# EAGLE design untitled (EAGLE 7.7.0)
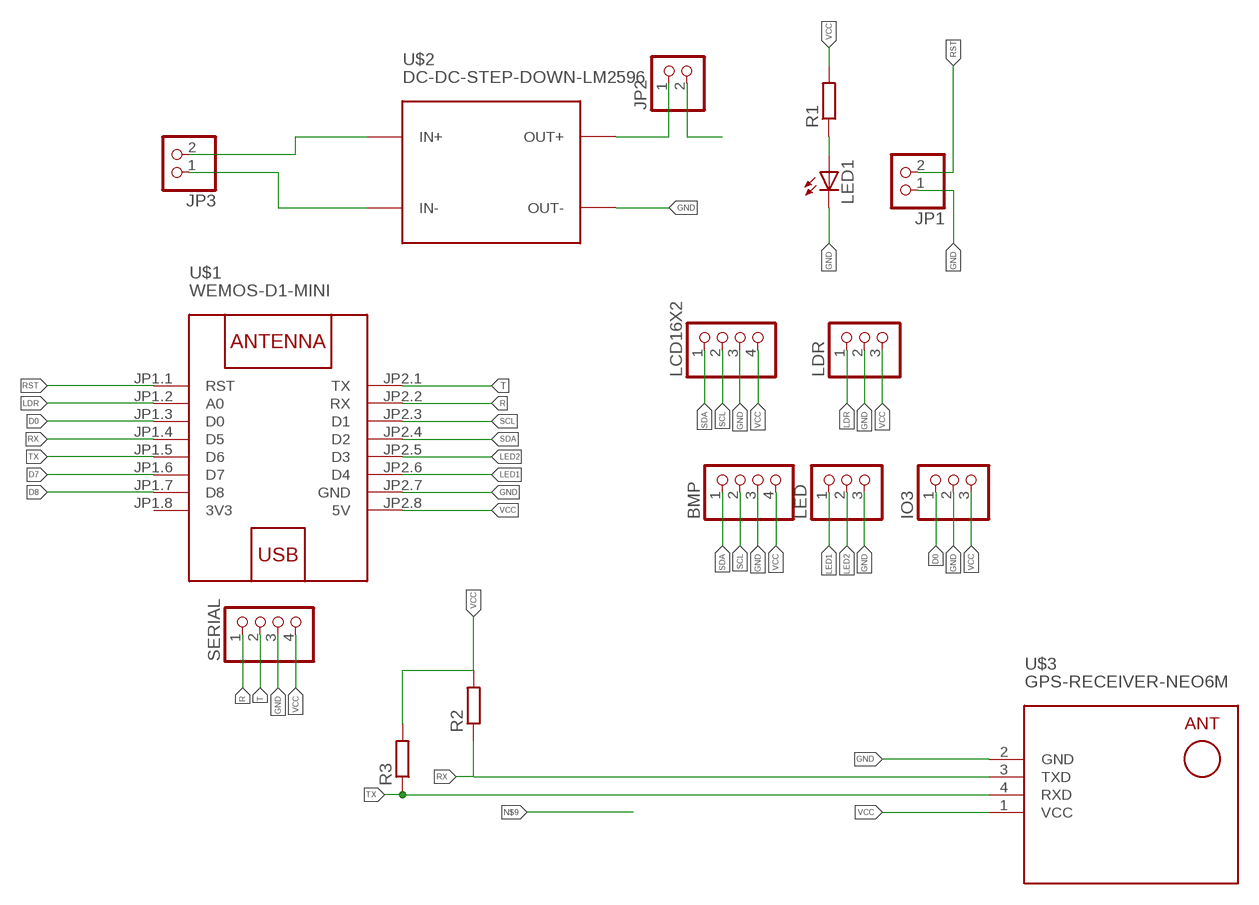
[diagram p0: schematic, sheet 1]

## Parts
BMP  PINHD-1X4  [1X04]
IO3  PINHD-1X3  [1X03]
JP1  PINHD-1X2  [1X02]
JP2  PINHD-1X2  [1X02]
JP3  PINHD-1X2  [1X02]
LCD16X2  PINHD-1X4  [1X04]
LDR  PINHD-1X3  [1X03]
LED  PINHD-1X3  [1X03]
LED1  LED5MM  [LED5MM]
R1  R-EU_0204/7  [0204/7]
R2  R-EU_0204/7  [0204/7]
R3  R-EU_0204/7  [0204/7]
SERIAL  PINHD-1X4  [1X04]
U$1  WEMOS-D1-MINI  [WEMOS-D1-MINI]
U$2  DC-DC-STEP-DOWN-LM2596  [DC-DC-STEP-DOWN-LM2596]
U$3  GPS-RECEIVER-NEO6M  [GPS-RECEIVER-NEO6M]

## Nets
D0: IO3.1 U$1.JP1.3(D0)
D7: U$1.JP1.6(D7)
D8: U$1.JP1.7(D8)
GND: BMP.3 IO3.2 JP1.1 LCD16X2.3 LDR.2 LED1.K(C) LED.3 SERIAL.3 U$1.JP2.7(GND) U$2.OUT- U$3.2(GND)
LDR: LDR.1 U$1.JP1.2(A0)
LED1: LED.1 U$1.JP2.6(D4)
LED2: LED.2 U$1.JP2.5(D3)
N$1: JP3.1 U$2.IN-
N$2: JP3.2 U$2.IN+
N$3: JP2.1 U$2.OUT+
N$4: LED1.A R1.1
R: SERIAL.1 U$1.JP2.2(RX)
RST: JP1.2 U$1.JP1.1(RST)
RX: R2.1 U$1.JP1.4(D5) U$3.3(TXD)
SCL: BMP.2 LCD16X2.2 U$1.JP2.3(D1)
SDA: BMP.1 LCD16X2.1 U$1.JP2.4(D2)
T: SERIAL.2 U$1.JP2.1(TX)
TX: R3.1 U$1.JP1.5(D6) U$3.4(RXD)
VCC: BMP.4 IO3.3 JP2.2 LCD16X2.4 LDR.3 R1.2 R2.2 R3.2 SERIAL.4 U$1.JP2.8(5V) U$3.1(VCC)

## Power pins joined to a net without a drawn wire
3V3: U$1.JP1.8(3V3)

## Library data of the parts
BMP LCD16X2 SERIAL = pinhead:PINHD-1X4: PIN HEADER
IO3 LDR LED = pinhead:PINHD-1X3: PIN HEADER
JP1-JP3 = pinhead:PINHD-1X2: PIN HEADER
LED1 = led:LED: LED OSRAM: - CHIPLED LG R971, LG N971, LY N971, LG Q971, LY Q971, LO R971, LY R971 LH N974, LH R974 LS Q976, LO Q976, LY Q976 LO Q996 - Hyper CHIPLED LW Q18S LB Q993, LB Q99A, LB R99A - SideLED LS A670, LO A670, LY A670, LG A670, LP A670 LB A673, LV A673, LT A673, LW A673 LH A674 LY A675 LS A676, LA A676, LO A676, LY A676, LW A676 LS A679, LY A679, LG A679 - Hyper Micro SIDELED® LS Y876, LA Y876, LO Y876, LY Y876 LT Y87S - SmartLED LW L88C, LW L88S LB L89C, LB L89S, LG L890 LS L89K, LO L89K, LY L89K LS L896, LA L896, LO L896, LY L896 - TOPLED LS T670, LO T670, LY T670, LG T670, LP T670 LSG T670, LSP T670, LSY T670, LOP T670, LYG T670 LG T671, LOG T671, LSG T671 LB T673, LV T673, LT T673, LW T673 LH T674 LS T676, LA T676, LO T676, LY T676, LB T676, LH T676, LSB T676, LW T676 LB T67C, LV T67C, LT T67C, LS T67K, LO T67K, LY T67K, LW E67C LS E67B, LA E67B, LO E67B, LY E67B, LB E67C, LV E67C, LT E67C LW T67C LS T679, LY T679, LG T679 LS T770, LO T770, LY T770, LG T770, LP T770 LB T773, LV T773, LT T773, LW T773 LH T774 LS E675, LA E675, LY E675, LS T675 LS T776, LA T776, LO T776, LY T776, LB T776 LHGB T686 LT T68C, LB T68C - Hyper Mini TOPLED® LB M676 - Mini TOPLED Santana® LG M470 LS M47K, LO M47K, LY M47K Source: http://www.osram.convergy.de/
R1-R3 = resistor:R-EU_: RESISTOR, European symbol
U$1 = diy-modules:WEMOS-D1-MINI: WEMOS D1 mini: Mini Wi-Fi Board based on ESP-8266 device More details can be found here: https://www.wemos.cc/product/d1-mini.html Click here to find device on ebay.com <http://www.ebay.com/sch/wemos+d1+mini+nodemcu>
U$2 = diy-modules:DC-DC-STEP-DOWN-LM2596: DC/DC Step-Down Regulator based on LM2596-ADJ chip LM2596 datasheet available here: http://www.ti.com/lit/ds/symlink/lm2596.pdf Click here to find device on ebay.com <http://www.ebay.com/sch/lm2596+power+regulator>
U$3 = diy-modules:GPS-RECEIVER-NEO6M: GPS Receiver Module based on NEO-6 device Short tutorial how to use NEO-6 module with Arduino: http://www.xarg.org/2016/06/neo6mv2-gps-module-with-arduino/ NEO-6 datasheet is available here: https://www.u-blox.com/sites/default/files/products/documents/NEO-6_DataSheet_%28GPS.G6-HW-09005%29.pdf Click here to find device on ebay.com <http://www.ebay.com/sch/gyneo6mv2>

## Board
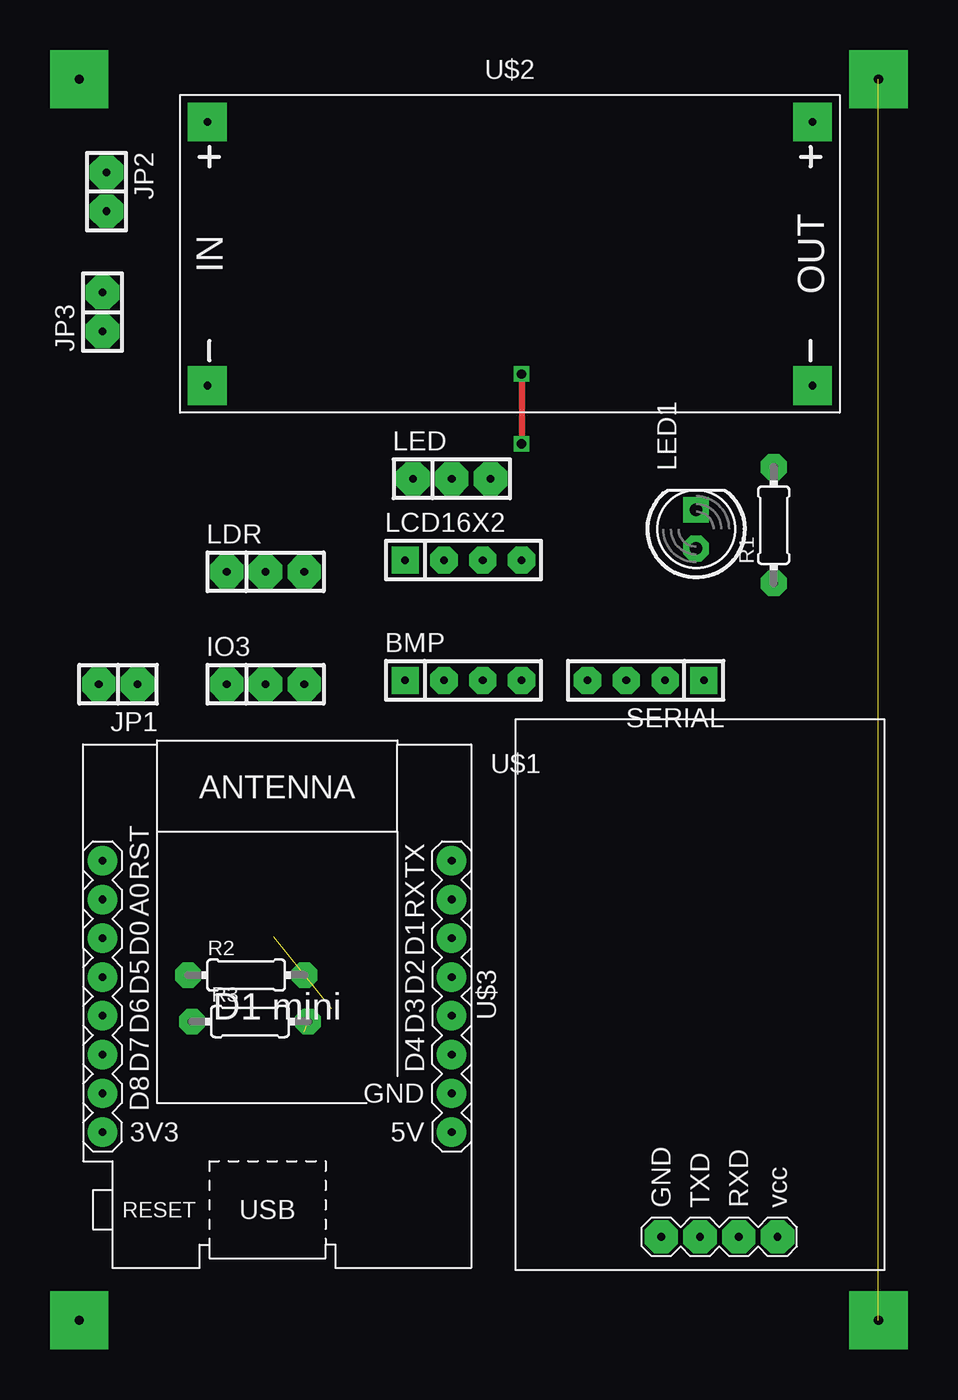
[diagram p1: board, top side]
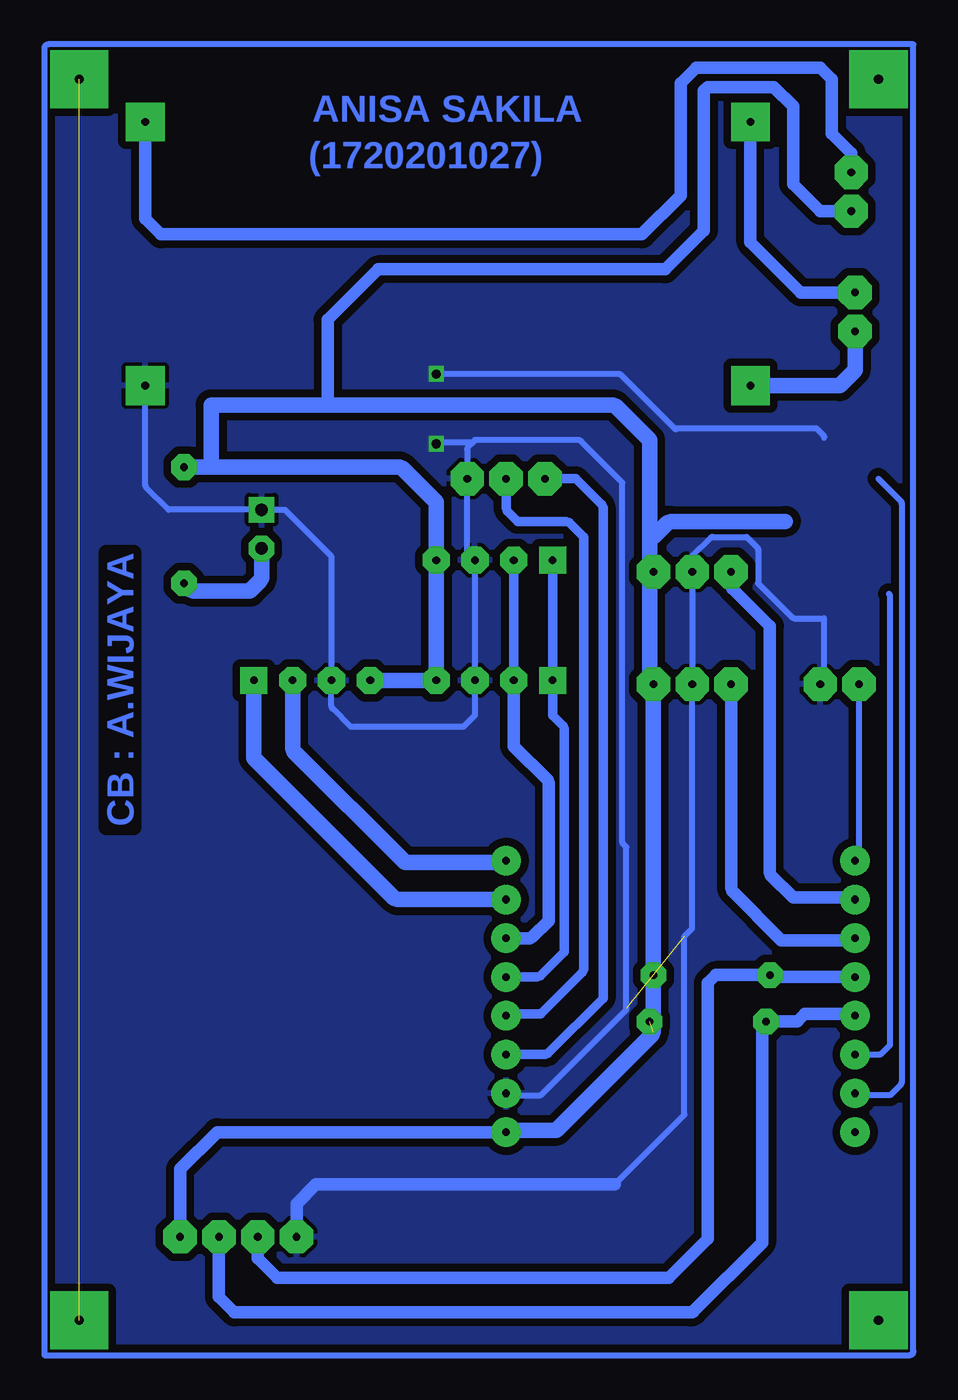
[diagram p2: board, bottom side, seen from below]

No outline drawn. Coordinates in mm, seen from the top.
Copper layers (1*16): Top 0.035mm / dielectric 1.5mm / Bottom 0.035mm
Design rules "default *": minimum track width 10mil, minimum drill 24mil, track to track 20mil, track to pad 20mil, pad to pad 20mil, via to via 20mil, smd to smd 8mil, copper to edge 20mil, drill to drill 8mil, minimum pad ring 10mil, minimum via ring 8mil, stop-mask expansion 4mil, vias tented up to drill 0mil, thermal gap 10mil

### Footprints (pad centres in the part's own frame; a part is rotated, then mirrored left to right if it is on the bottom)
1X04 = drill 0.5 pad 1.778 square: 1 -3.81,0 | drill 0.5 pad 1.778 octagon: 2 -1.27,0; 3 1.27,0; 4 3.81,0
1X03 = drill 0.5 pad 2.184 octagon: 1 -2.54,0; 2 0,0; 3 2.54,0
1X02 = drill 0.5 pad 2.184 octagon: 1 -1.27,0; 2 1.27,0
LED5MM = drill 0.813 pad 1.676 octagon: A -1.27,0 | drill 0.813 pad 1.676 square: K 1.27,0
0204/7 = drill 0.5 pad 1.676 octagon: 1 -3.81,0; 2 3.81,0
WEMOS-D1-MINI = drill 0.5 pad 1.93: JP1.1 -11.43,9.525; JP1.2 -11.43,6.985; JP1.3 -11.43,4.445; JP1.4 -11.43,1.905; JP1.5 -11.43,-0.635; JP1.6 -11.43,-3.175; JP1.7 -11.43,-5.715; JP1.8 -11.43,-8.255; JP2.1 11.43,9.525; JP2.2 11.43,6.985; JP2.3 11.43,4.445; JP2.4 11.43,1.905; JP2.5 11.43,-0.635; JP2.6 11.43,-3.175; JP2.7 11.43,-5.715; JP2.8 11.43,-8.255
DC-DC-STEP-DOWN-LM2596 = drill 0.5 pad 2.54 square: IN+ -19.812,8.636; IN- -19.812,-8.636; OUT+ 19.812,8.636; OUT- 19.812,-8.636
GPS-RECEIVER-NEO6M = drill 0.5 pad 2.184 octagon: 1 -15.875,-5.08; 2 -15.875,2.54; 3 -15.875,0; 4 -15.875,-2.54

### Placement (x,y rotation side)
BMP  27.43,58.42 0 top
IO3  14.48,58.17 0 top
JP1  4.83,58.17 180 top
JP2  4.06,90.42 270 top
JP3  3.81,82.55 90 top
LCD16X2  27.43,66.29 0 top
LDR  14.48,65.53 0 top
LED  26.67,71.63 0 top
LED1  42.67,68.33 90 top
R1  47.75,68.58 90 top
R2  13.21,39.12 0 top
R3  13.46,36.07 0 top
SERIAL  39.37,58.42 180 top
U$1  15.24,37.08 0 top
U$2  30.48,86.36 0 top
U$3  42.93,37.85 90 top

### Tracks (layer width: path | path; a pad name or v marks a point on that pad's centre or on a via)
D0
  Bottom 0.406: U$1.JP1.3 3.86,41.48 arc45 4.04,41.4 | 11.86,44.63 arc45 11.94,44.81
  Bottom 0.813: 4.04,41.4 8.64,41.4 11.86,44.63 | 11.94,44.81 IO3.1
D7
  Bottom 0.406: U$1.JP1.6 2.26,33.91 arc-45 2.08,33.98 1.52,34.54 1.52,63.9 arc-45 1.6,64.08
D8
  Bottom 0.406: U$1.JP1.7 3.76,31.32 arc-45 3.58,31.24 1.52,31.24 0.84,31.93 arc-45 0.76,32.11 0.76,70 arc-45 0.84,70.18 2.29,71.63
GND  (via drill 0.6)  (1 unrouted)
  Top 0.406: v31.24,78.49 v31.24,73.91
  Bottom 0.406: JP1.1 5.92,58.35 arc-45 5.84,58.52 5.84,62.48 7.77,62.48 arc45 7.95,62.56 10.16,64.77 10.16,66.95 arc-45 10.23,67.13 10.92,67.82 13.1,67.82 arc-45 13.28,67.74 14.48,66.55 LDR.2 IO3.2 14.48,42.16 14.99,41.66 14.99,29.97 19.56,25.4 | U$1.JP2.7 26.62,31.32 arc-45 26.44,31.24 24.38,31.24 18.87,36.76 arc-45 18.8,36.94 18.8,47.5 18.98,47.68 arc45 19.05,47.86 19.05,71.37 21.77,74.09 | 21.77,74.09 arc-45 21.95,74.17 | 21.95,74.17 28.7,74.17 28.83,74.04 | 28.83,74.04 29.14,73.73 arc-45 29.21,73.56 LED.3 29.21,66.91 arc-45 29.14,66.73 LCD16X2.3 BMP.3 28.7,56.13 29.39,55.45 arc45 29.57,55.37 36.83,55.37 38.03,56.57 arc45 38.1,56.75 SERIAL.3 38.1,66.44 arc-45 38.17,66.62 41.15,69.6 LED1.K 48.77,69.6 50.22,71.05 arc45 50.29,71.22 U$2.OUT- | 5.84,74.32 arc-45 5.92,74.5 6.35,74.93 15.39,74.93 arc-45 15.57,74.86 19.12,78.41 arc-45 19.3,78.49 v31.24,78.49 | v31.24,73.91 31.19,73.97 arc45 31.01,74.04 28.83,74.04 | 21.77,74.09 arc-45 21.95,74.17
  Bottom 0.813: U$3.2 40.39,24.13 39.12,25.4 19.56,25.4
  pour Bottom: 1.02,100.08 56.64,100.08 arc-90 56.9,99.82 56.9,14.22 0.25,14.22 arc-90 0,14.48 0,100.08
LDR
  Bottom 0.406: U$1.JP1.2 3.86,44.12 arc-45 4.04,44.2 | 9.32,45.65 arc45 9.4,45.83 | 11.86,64.44 arc45 11.94,64.62
  Bottom 0.813: 4.04,44.2 7.87,44.2 9.32,45.65 | 9.4,45.83 9.4,61.98 11.86,64.44 | 11.94,64.62 LDR.1
LED1
  Bottom 0.406: 20.39,69.92 arc45 20.32,69.75 | 23.93,33.98 arc45 24.11,33.91
  Bottom 0.61: LED.1 22.1,71.63 20.39,69.92 | 20.32,69.75 20.32,37.59 23.93,33.98 | 24.11,33.91 U$1.JP2.6
LED2
  Bottom 0.406: U$1.JP2.5 26.62,36.5 arc45 26.44,36.58 | 21.66,39.3 arc-45 21.59,39.48 | 22.53,68.76 arc-45 22.71,68.83 | 26.6,69.52 arc45 26.67,69.7
  Bottom 0.61: 26.44,36.58 24.38,36.58 21.66,39.3 | 21.59,39.48 21.59,67.82 22.53,68.76 | 22.71,68.83 25.91,68.83 26.6,69.52 | 26.67,69.7 LED.2
N$1
  Bottom 1.016: JP3.1 3.81,78.74 4.83,77.72 U$2.IN-
N$2
  Bottom 0.813: JP3.2 7.37,83.82 10.67,87.12 U$2.IN+
N$3
  Bottom 0.813: JP2.1 4.06,92.96 5.33,94.23 5.33,97.79 6.1,98.55 14.22,98.55 15.24,97.54 15.24,90.17 17.78,87.63 49.28,87.63 50.29,88.65 U$2.OUT+
N$4
  Bottom 0.406: 47.32,64.34 arc-45 47.14,64.26 | 42.75,64.95 arc-45 42.67,65.13
  Bottom 1.016: R1.1 47.32,64.34 | 47.14,64.26 43.43,64.26 42.75,64.95 | 42.67,65.13 LED1.A
N$5  (via drill 0.6 pad 3.81)
  other vias: 2.29,97.79
N$6  (via drill 0.6 pad 3.81)  (1 unrouted)
  other vias: 54.61,97.79 54.61,16.51
N$7
  Bottom 0.406: 0,100.08 56.64,100.08 arc-90 56.9,99.82 56.9,14.22 0.25,14.22 arc-90 0,14.48 0,100.08
N$8  (via drill 0.6 pad 3.81)
  other vias: 2.29,16.51
R
  Bottom 0.406: 33.98,44.14 arc-45 33.8,44.07
  Bottom 1.016: SERIAL.1 43.18,53.34 33.98,44.14 | 33.8,44.07 U$1.JP2.2
RST
  Bottom 0.406: U$1.JP1.1 3.63,46.79 arc-45 3.56,46.97 JP1.2
RX
  Bottom 0.406: R2.1 8.84,38.91 arc45 8.66,38.99
  Bottom 0.813: 8.66,38.99 U$1.JP1.4 | R2.1 12.95,39.12 13.46,38.61 13.46,21.84 16,19.3 41.66,19.3 42.93,20.57 U$3.3
SCL
  Bottom 0.406: 23.95,51.89 arc45 23.88,51.71 | 24.95,41.6 arc45 25.12,41.53
  Bottom 0.61: BMP.2 LCD16X2.2
  Bottom 0.813: BMP.2 26.16,54.1 23.95,51.89 | 23.88,51.71 23.88,42.67 24.95,41.6 | 25.12,41.53 U$1.JP2.3
SDA
  Bottom 0.406: 22.93,55.45 arc45 22.86,55.27 | 24.44,39.06 arc45 24.62,38.99
  Bottom 0.61: LCD16X2.1 BMP.1 23.62,56.13 22.93,55.45 | 22.86,55.27 22.86,40.64 24.44,39.06 | 24.62,38.99 U$1.JP2.4
T
  Bottom 0.406: U$1.JP2.1 26.72,46.56 arc45 26.9,46.48 | 40.57,53.77 arc45 40.64,53.95
  Bottom 1.016: 26.9,46.48 33.27,46.48 40.57,53.77 | 40.64,53.95 SERIAL.2
TX
  Bottom 0.813: U$1.JP1.5 3.86,36.5 arc-45 4.04,36.58 7.11,36.58 7.55,36.14 arc45 7.72,36.07 R3.1 9.83,35.89 arc-45 9.91,35.71 9.91,21.59 14.4,17.09 arc45 14.58,17.02 44.45,17.02 45.47,18.03 U$3.4
VCC  (1 unrouted)
  Bottom 0.406: U$1.JP2.8 26.62,28.88 | 17.09,35.23 arc-45 17.02,35.41 | 17.02,67.82 LDR.3 IO3.3 17.2,58.35 arc45 17.27,58.52 | 16.08,68.76 arc45 15.9,68.83 | 33.45,72.32 arc-45 33.63,72.39 | 19.48,76.38 arc-45 19.66,76.45
  Bottom 0.813: U$3.1 48.01,26.42 45.59,28.83 U$1.JP2.8 | JP2.2 6.1,89.15 7.87,90.93 7.87,96.01 9.14,97.28 13.46,97.28 13.72,97.03 13.72,87.88 16.26,85.34 35.05,85.34 38.35,82.04 38.35,76.45
  Bottom 1.016: SERIAL.4 BMP.4 LCD16X2.4 31.24,70.1 33.45,72.32 | 26.62,28.88 arc45 26.44,28.96 23.37,28.96 17.09,35.23 | 17.02,35.41 R2.2 IO3.3 | 17.02,67.82 16.08,68.76 | 15.9,68.83 8.38,68.83 | 33.63,72.39 45.97,72.39 | 45.97,72.39 R1.2 | 45.97,72.39 45.97,76.45 38.35,76.45 19.66,76.45 | 17.27,58.52 17.27,74.17 19.48,76.38

### Text on the board
Bottom: ANISA SAKILA | (1720201027) | CB : A.WIJAYA